# Altium project FlightController.PrjPcb
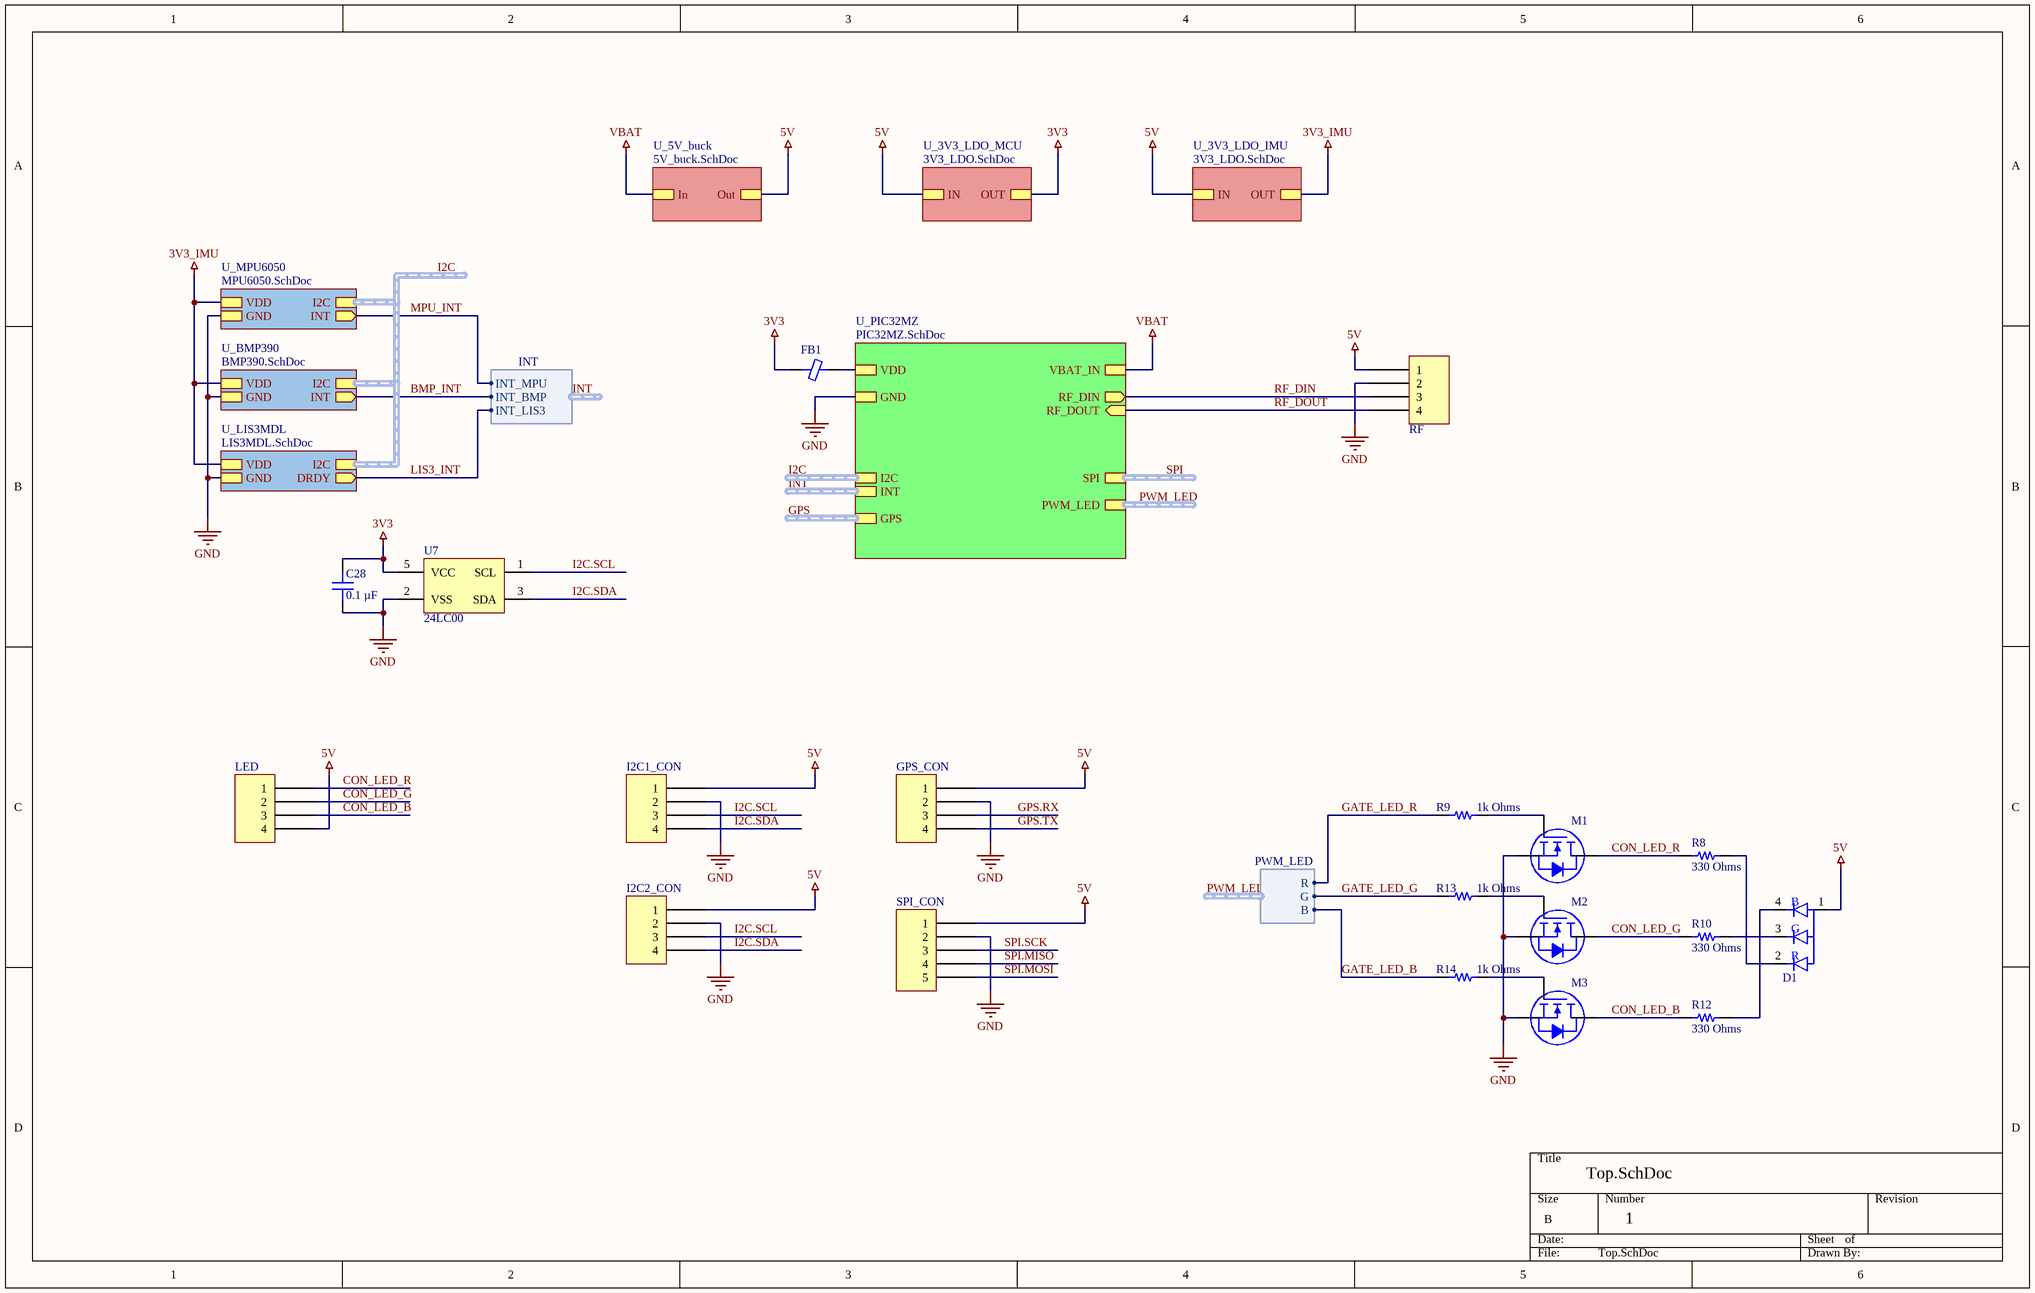
[diagram p0: Top.SchDoc]
3 sheets, 52 parts. Net scope: hierarchical (ports join the sheet entries above them; power ports are global).
Board file: FlightController.PcbDoc
Sheets:
  Top.SchDoc
    U_PIC32MZ = PIC32MZ.SchDoc
    U_3V3_LDO_MCU = 3V3_LDO.SchDoc
    U_3V3_LDO_IMU = 3V3_LDO.SchDoc

## Sheet Top.SchDoc
size B; SheetNumber: 1; SheetTotal: 7

### Parts
C28  0.1 µF  [CAP 0402_1005]
D1  RGB LED 3228  [CreeLED 3228]  (value not drawn)
FB1  (no value)  [FER 0805_2012]
GPS_CON  SM04B-SRSS-TB(LF)(SN)  [JST SM04B-SRSS-TB]  (value not drawn)
I2C1_CON  SM04B-SRSS-TB(LF)(SN)  [JST SM04B-SRSS-TB]  (value not drawn)
I2C2_CON  SM04B-SRSS-TB(LF)(SN)  [JST SM04B-SRSS-TB]  (value not drawn)
LED  SM04B-SRSS-TB(LF)(SN)  [JST SM04B-SRSS-TB]  (value not drawn)
M1  BSS123-7-F  [DIODES SOT-23-3]  (value not drawn)
M2  BSS123-7-F  [DIODES SOT-23-3]  (value not drawn)
M3  BSS123-7-F  [DIODES SOT-23-3]  (value not drawn)
R8  330 Ohms  [RES 0603_1608]
R9  1k Ohms  [RES 0402_1005]
R10  330 Ohms  [RES 0603_1608]
R12  330 Ohms  [RES 0603_1608]
R13  1k Ohms  [RES 0402_1005]
R14  1k Ohms  [RES 0402_1005]
RF  SM04B-SRSS-TB(LF)(SN)  [JST SM04B-SRSS-TB]  (value not drawn)
SPI_CON  SM05B-SRSS-TB(LF)(SN)  [JST SM05B-SRSS-TB]  (value not drawn)
U7  24LC00  [SOT-23-5]

### Sub-sheets
U_3V3_LDO_IMU = 3V3_LDO.SchDoc: OUT, IN
U_3V3_LDO_MCU = 3V3_LDO.SchDoc: OUT, IN
U_5V_buck = 5V_buck.SchDoc (file not in this document): Out, In
U_BMP390 = BMP390.SchDoc (file not in this document): VDD, GND, I2C (harness I2C), INT (out)
U_LIS3MDL = LIS3MDL.SchDoc (file not in this document): VDD, GND, I2C (harness I2C), DRDY (out)
U_MPU6050 = MPU6050.SchDoc (file not in this document): VDD, GND, I2C (harness I2C), INT (out)
U_PIC32MZ = PIC32MZ.SchDoc: RF_DIN (out), RF_DOUT (in), GND, VDD, VBAT_IN, I2C (harness I2C), GPS (harness GPS), PWM_LED (harness PWM_LED), INT (harness INT), SPI (harness SPI)

### Harnesses
PWM_LED: R, B, G
INT: INT_MPU, INT_BMP, INT_LIS3

### Nets
3V3: C28.2 FB1.1 U7.5(VCC) ; sheet U_3V3_LDO_MCU/OUT
3V3_IMU: sheet U_3V3_LDO_IMU/OUT, sheet U_MPU6050/VDD, sheet U_BMP390/VDD, sheet U_LIS3MDL/VDD
5V: D1.1(A) GPS_CON.1 I2C1_CON.1 I2C2_CON.1 LED.4 RF.1 SPI_CON.1 ; sheet U_3V3_LDO_MCU/IN, sheet U_3V3_LDO_IMU/IN, sheet U_5V_buck/Out
GND: C28.1 GPS_CON.2 I2C1_CON.2 I2C2_CON.2 M1.2(S) M2.2(S) M3.2(S) RF.2 SPI_CON.2 U7.2(VSS) ; sheet U_PIC32MZ/GND, sheet U_MPU6050/GND, sheet U_BMP390/GND, sheet U_LIS3MDL/GND
VBAT: sheet U_PIC32MZ/VBAT_IN, sheet U_5V_buck/In
BMP_INT: sheet U_BMP390/INT, sheet U_PIC32MZ/INT.INT_BMP
CON_LED_B: LED.3 M3.3(D) R12.1
CON_LED_G: LED.2 M2.3(D) R10.1
CON_LED_R: LED.1 M1.3(D) R8.1
GATE_LED_B: R14.2 ; sheet U_PIC32MZ/PWM_LED.B
GATE_LED_G: R13.2 ; sheet U_PIC32MZ/PWM_LED.G
GATE_LED_R: R9.2 ; sheet U_PIC32MZ/PWM_LED.R
GPS.RX: GPS_CON.3
GPS.TX: GPS_CON.4
I2C.SCL: I2C1_CON.3 I2C2_CON.3 U7.1(SCL)
I2C.SDA: I2C1_CON.4 I2C2_CON.4 U7.3(SDA)
LIS3_INT: sheet U_LIS3MDL/DRDY, sheet U_PIC32MZ/INT.INT_LIS3  [project net INT.INT_LIS3]
MCU_VDD: FB1.2 ; sheet U_PIC32MZ/VDD
MPU_INT: sheet U_MPU6050/INT, sheet U_PIC32MZ/INT.INT_MPU  [project net INT.INT_MPU]
RF_DIN: RF.3 ; sheet U_PIC32MZ/RF_DIN
RF_DOUT: RF.4 ; sheet U_PIC32MZ/RF_DOUT
SPI.MISO: SPI_CON.4
SPI.MOSI: SPI_CON.5
SPI.SCK: SPI_CON.3
NetD1_2: D1.2(BLUE(C)) R8.2
NetD1_3: D1.3(BLUE(C)) R10.2
NetD1_4: D1.4(BLUE(C)) R12.2
NetM1_1: M1.1(G) R9.1
NetM2_1: M2.1(G) R13.1
NetM3_1: M3.1(G) R14.1

### Buses and harness runs
harness GPS = sheet U_PIC32MZ/GPS
harness I2C = sheet U_BMP390/I2C = sheet U_LIS3MDL/I2C = sheet U_MPU6050/I2C
harness I2C = sheet U_PIC32MZ/I2C
harness INT = sheet U_PIC32MZ/INT
harness PWM_LED = sheet U_PIC32MZ/PWM_LED
harness SPI = sheet U_PIC32MZ/SPI

### Notes on the sheet
- (in symbol RGB LED 3228) B; G; R

### Library data of the parts
C28 = C0402C104K4RACAUTO: CAP CER 0.1UF 16V X7R 0402; manufacturer: KEMET; Tolerance: ±10%; Part Number: C0402C104K4RACAUTO; Value: 0.1 µF; Applications: Automotive, Bypass, Decoupling; Capacitance: 0.1 µF; componentlink1description: Datasheet; componentlink1url: https://api.kemet.com/component-edge/download/specsheet/C0402C104K4RACAUTO.pdf; componentlink2description: DigiKey Link; componentlink2url: https://www.digikey.com/en/products/detail/kemet/C0402C104K4RACAUTO/3314827; Device Package: 0402 (1005 Metric); lastupdated: 8/14/2022 9:05:51 PM; Lifecycle Status: Active; Minimum Order: 1; Mounting Type: Surface Mount, MLCC; Operating Temperature: -55°C ~ 125°C; Package / Case: 0402 (1005 Metric); packaging: TapeAndReel; partid: 3024; Part Status: Active; price: 0.01; Ratings: AEC-Q200; series: SMD Auto X7R; Size / Dimension: 0.039" L x 0.020" W (1.00mm x 0.50mm); Supplier 1: DigiKey; Supplier Part Number 1: 399-6828-1-ND; Temperature Coefficient: X7R; Thickness (Max): 0.022" (0.55mm); Voltage - Rated: 16V
D1 = RGB LED 3228: DIODE LED RGB DIFFUSED 4LCC SMD CLV1L-FKB-CJ1N1E1BB7B3B3; Manufacturer: Cree; ComponentLink2Description: Datasheet; Temperature: -40°C to +100°C; Package: LED_3MM2X2MM8; Supplier 2: Mouser; Price: 0.203999996142; Supplier 1: Digi-Key; ComponentLink1URL: https://upverter.com/upn/revision/9d0b31f7b1982705/; Supplier Part Number 2: 941-CLV1LFKBC7673673; Supplier Part Number 1: CLV1L-FKB-CHMMQEHBB7673673-ND; ComponentLink1Description: Upverter; ComponentLink2URL: http://www.cree.com/~/media/Files/Cree/LED-Components-and-Modules/HB/Data-Sheets/CLV1L-FKB-1238.pdf; RoHS: TRUE; Mouser Part Number: 941-CLV1LFKBC7673673; Temperature Range High: +100°C; Digikey Description: DIODE LED RGB DIFFUSED 4LCC SMD; Digikey Part Number: CLV1L-FKB-CHMMQEHBB7673673-ND; Lead Free: yes; Temperature Range Low: -40°C
FB1 = 2508051017Y0: FERRITE BEAD 0805 1LN; Manufacturer: Fair-Rite Products Corp.; Current Rating (Max): 300mA; DC Resistance (DCR) (Max): 200mOhm; Filter Type: Signal Line; Number of Lines: 1; Part Number: 2508051017Y0; ComponentLink1Description: Datasheet; ComponentLink1URL: http://www.fair-rite.com/wp-content/themes/fair-rite/print_product.php?pid=19091; ComponentLink2Description: DigiKey Link; ComponentLink2URL: http://digikey.com/product-detail/en/fair-rite-products-corp/2508051017Y0/1934-1435-1-ND/8594382; Device Package: 0805 (2012 Metric); Height (Max): 0.043" (1.10mm); LastUpdated: 9/2/2020 1:18:22 AM; Lifecycle Status: Active; Minimum Order: 1; Mounting Type: Surface Mount; Operating Temperature: -55°C ~ 125°C; Package / Case: 0805 (2012 Metric); Packaging: TapeAndReel; PartId: 1308; Part Status: Active; Price: 0.02; Series: -; Size / Dimension: 0.079" L x 0.049" W (2.00mm x 1.25mm); Supplier 1: DigiKey; Supplier Part Number 1: 1934-1435-1-ND
GPS_CON I2C1_CON I2C2_CON LED RF = SM04B-SRSS-TB(LF)(SN): CONN HEADER SMD R/A 4POS 1MM; Manufacturer: JST Sales America Inc.; Current Rating (Amps): 0.7A; Material Flammability Rating: UL94 V-0; Number of Positions: 4; Number of Positions Loaded: All; Pitch - Mating: 0.039" (1.00mm); Shrouding: Shrouded - 4 Wall; Style: Board to Cable/Wire; Voltage Rating: 50V; Part Number: SM04B-SRSS-TB(LF)(SN); ComponentLink1Description: Datasheet; ComponentLink1URL: http://www.jst-mfg.com/product/pdf/eng/eSH.pdf; ComponentLink2Description: DigiKey Link; ComponentLink2URL: http://digikey.com/product-detail/en/jst-sales-america-inc/SM04B-SRSS-TB-LF-SN/455-1804-1-ND/926875; Connector Type: Header; Contact Finish - Mating: Tin; Contact Finish - Post: Tin; Contact Material: Copper Alloy; Contact Shape: Square; Contact Type: Male Pin; Fastening Type: Push-Pull; Features: Solder Retention; Insulation Color: Natural; Insulation Height: 0.114" (2.90mm); Insulation Material: Polyamide (PA), Nylon; LastUpdated: 1/12/2020 11:41:52 PM; Lifecycle Status: Active; Minimum Order: 1; Mounting Type: Surface Mount, Right Angle; Number of Rows: 1; Operating Temperature: -25°C ~ 85°C; Packaging: TapeAndReel; PartId: 62; Part Status: Active; Price: 0.26; Series: SR; Supplier 1: DigiKey; Supplier Part Number 1: 455-1804-1-ND; Termination: Solder
M1-M3 = BSS123-7-F: MOSFET N-CH 100V 170MA SOT23-3; Manufacturer: Diodes Incorporated; Current - Continuous Drain (Id) @ 25°C: 170mA (Ta); Drive Voltage (Max Rds On,  Min Rds On): 10V; FET Type: N-Channel; Input Capacitance (Ciss) (Max) @ Vds: 60pF @ 25V; Power Dissipation (Max): 300mW (Ta); Rds On (Max) @ Id, Vgs: 6Ohm @ 170mA, 10V; Vgs (Max): ±20V; Vgs(th) (Max) @ Id: 2V @ 1mA; Part Number: BSS123-7-F; ComponentLink1Description: Datasheet; ComponentLink1URL: https://www.diodes.com/assets/Datasheets/ds30366.pdf; ComponentLink2Description: DigiKey Link; ComponentLink2URL: http://digikey.com/product-detail/en/diodes-incorporated/BSS123-7-F/BSS123-FDICT-ND/717842; Drain to Source Voltage (Vdss): 100V; LastUpdated: 8/14/2022 10:06:21 PM; Lifecycle Status: Active; Minimum Order: 1; Mounting Type: Surface Mount; Operating Temperature: -55°C ~ 150°C (TJ); Package / Case: TO-236-3, SC-59, SOT-23-3; Packaging: TapeAndReel; Part Status: Active; Price: 0.05; Series: -; Supplier 1: DigiKey; Supplier Part Number 1: BSS123-FDICT-ND; Supplier Device Package: SOT-23-3; Technology: MOSFET (Metal Oxide)
R8 R10 R12 = RNCS0603BKE10K0: RES 10K OHM 0.1% 1/16W 0603; Manufacturer: Stackpole Electronics Inc; Power (Watts): 0.063W, 1/16W; Resistance: 10 kOhms; Temperature Coefficient: ±25ppm/°C; Part Number: RNCS0603BKE10K0; Value: 330 Ohms; ComponentLink1Description: Datasheet; ComponentLink1URL: https://www.seielect.com/catalog/sei-rncs_rnch.pdf; ComponentLink2Description: DigiKey Link; ComponentLink2URL: https://www.digikey.com/en/products/detail/stackpole-electronics-inc/RNCS0603BKE10K0/1708836; Composition: Thin Film; Device Package: 0603 (1608 Metric); Features: Anti-Corrosive, Automotive AEC-Q200, Moisture Resistant; Height - Seated (Max): 0.022" (0.55mm); LastUpdated: 8/14/2022 9:31:27 PM; Lifecycle Status: Active; Minimum Order: 1; Number of Terminations: 2; Operating Temperature: -55°C ~ 155°C; Package / Case: 0603 (1608 Metric); Packaging: TapeAndReel; PartId: 4838; Part Status: Active; Price: 0.08; Ratings: AEC-Q200; Series: RNCS; Size / Dimension: 0.061" L x 0.031" W (1.55mm x 0.80mm); Supplier 1: DigiKey; Supplier Part Number 1: RNCS0603BKE10K0CT-ND; Supplier Device Package: 0603; Tolerance: ±0.1%
R9 R13 R14 = CRCW0402330RJNEDC: RES 330 OHM 5% 1/16W 0402; Manufacturer: Vishay Dale; Power (Watts): 0.063W, 1/16W; Resistance: 330 Ohms; Temperature Coefficient: ±200ppm/°C; Part Number: CRCW0402330RJNEDC; Value: 1k Ohms; ComponentLink1Description: Datasheet; ComponentLink1URL: http://www.vishay.com/docs/28773/crcwce3.pdf; ComponentLink2Description: DigiKey Link; ComponentLink2URL: https://www.digikey.com/en/products/detail/vishay-dale/CRCW0402330RJNEDC/7928545; Composition: Thick Film; Device Package: 0402 (1005 Metric); Height - Seated (Max): 0.014" (0.35mm); LastUpdated: 8/14/2022 9:23:31 PM; Lifecycle Status: Active; Minimum Order: 1; Number of Terminations: 2; Operating Temperature: -55°C ~ 155°C; Package / Case: 0402 (1005 Metric); Packaging: CutTape; PartId: 15989; Part Status: Active; Price: 0.01; Series: CRCW-C; Size / Dimension: 0.039" L x 0.020" W (1.00mm x 0.50mm); Supplier 1: DigiKey; Supplier Part Number 1: 541-4123-1-ND; Supplier Device Package: 0402; Tolerance: ±5%
SPI_CON = SM05B-SRSS-TB(LF)(SN): CONN HEADER SMD R/A 5POS 1MM; Manufacturer: JST Sales America Inc.; Current Rating (Amps): 0.7A; Material Flammability Rating: UL94 V-0; Number of Positions: 5; Number of Positions Loaded: All; Pitch - Mating: 0.039" (1.00mm); Shrouding: Shrouded - 4 Wall; Style: Board to Cable/Wire; Voltage Rating: 50V; Part Number: SM05B-SRSS-TB(LF)(SN); ComponentLink1Description: Datasheet; ComponentLink1URL: http://www.jst-mfg.com/product/pdf/eng/eSH.pdf; ComponentLink2Description: DigiKey Link; ComponentLink2URL: http://digikey.com/product-detail/en/jst-sales-america-inc/SM05B-SRSS-TB-LF-SN/455-1805-1-ND/926876; Connector Type: Header; Contact Finish - Mating: Tin; Contact Finish - Post: Tin; Contact Material: Copper Alloy; Contact Shape: Square; Contact Type: Male Pin; Fastening Type: Push-Pull; Features: Solder Retention; Insulation Color: Natural; Insulation Height: 0.114" (2.90mm); Insulation Material: Polyamide (PA), Nylon; LastUpdated: 1/12/2020 11:42:04 PM; Lifecycle Status: Active; Minimum Order: 1; Mounting Type: Surface Mount, Right Angle; Number of Rows: 1; Operating Temperature: -25°C ~ 85°C; Packaging: TapeAndReel; PartId: 63; Part Status: Active; Price: 0.32; Series: SR; Supplier 1: DigiKey; Supplier Part Number 1: 455-1805-1-ND; Termination: Solder
U7 = 24LC00: EEPROM

## Sheet PIC32MZ.SchDoc
size B; SheetNumber: 2; SheetTotal: 7
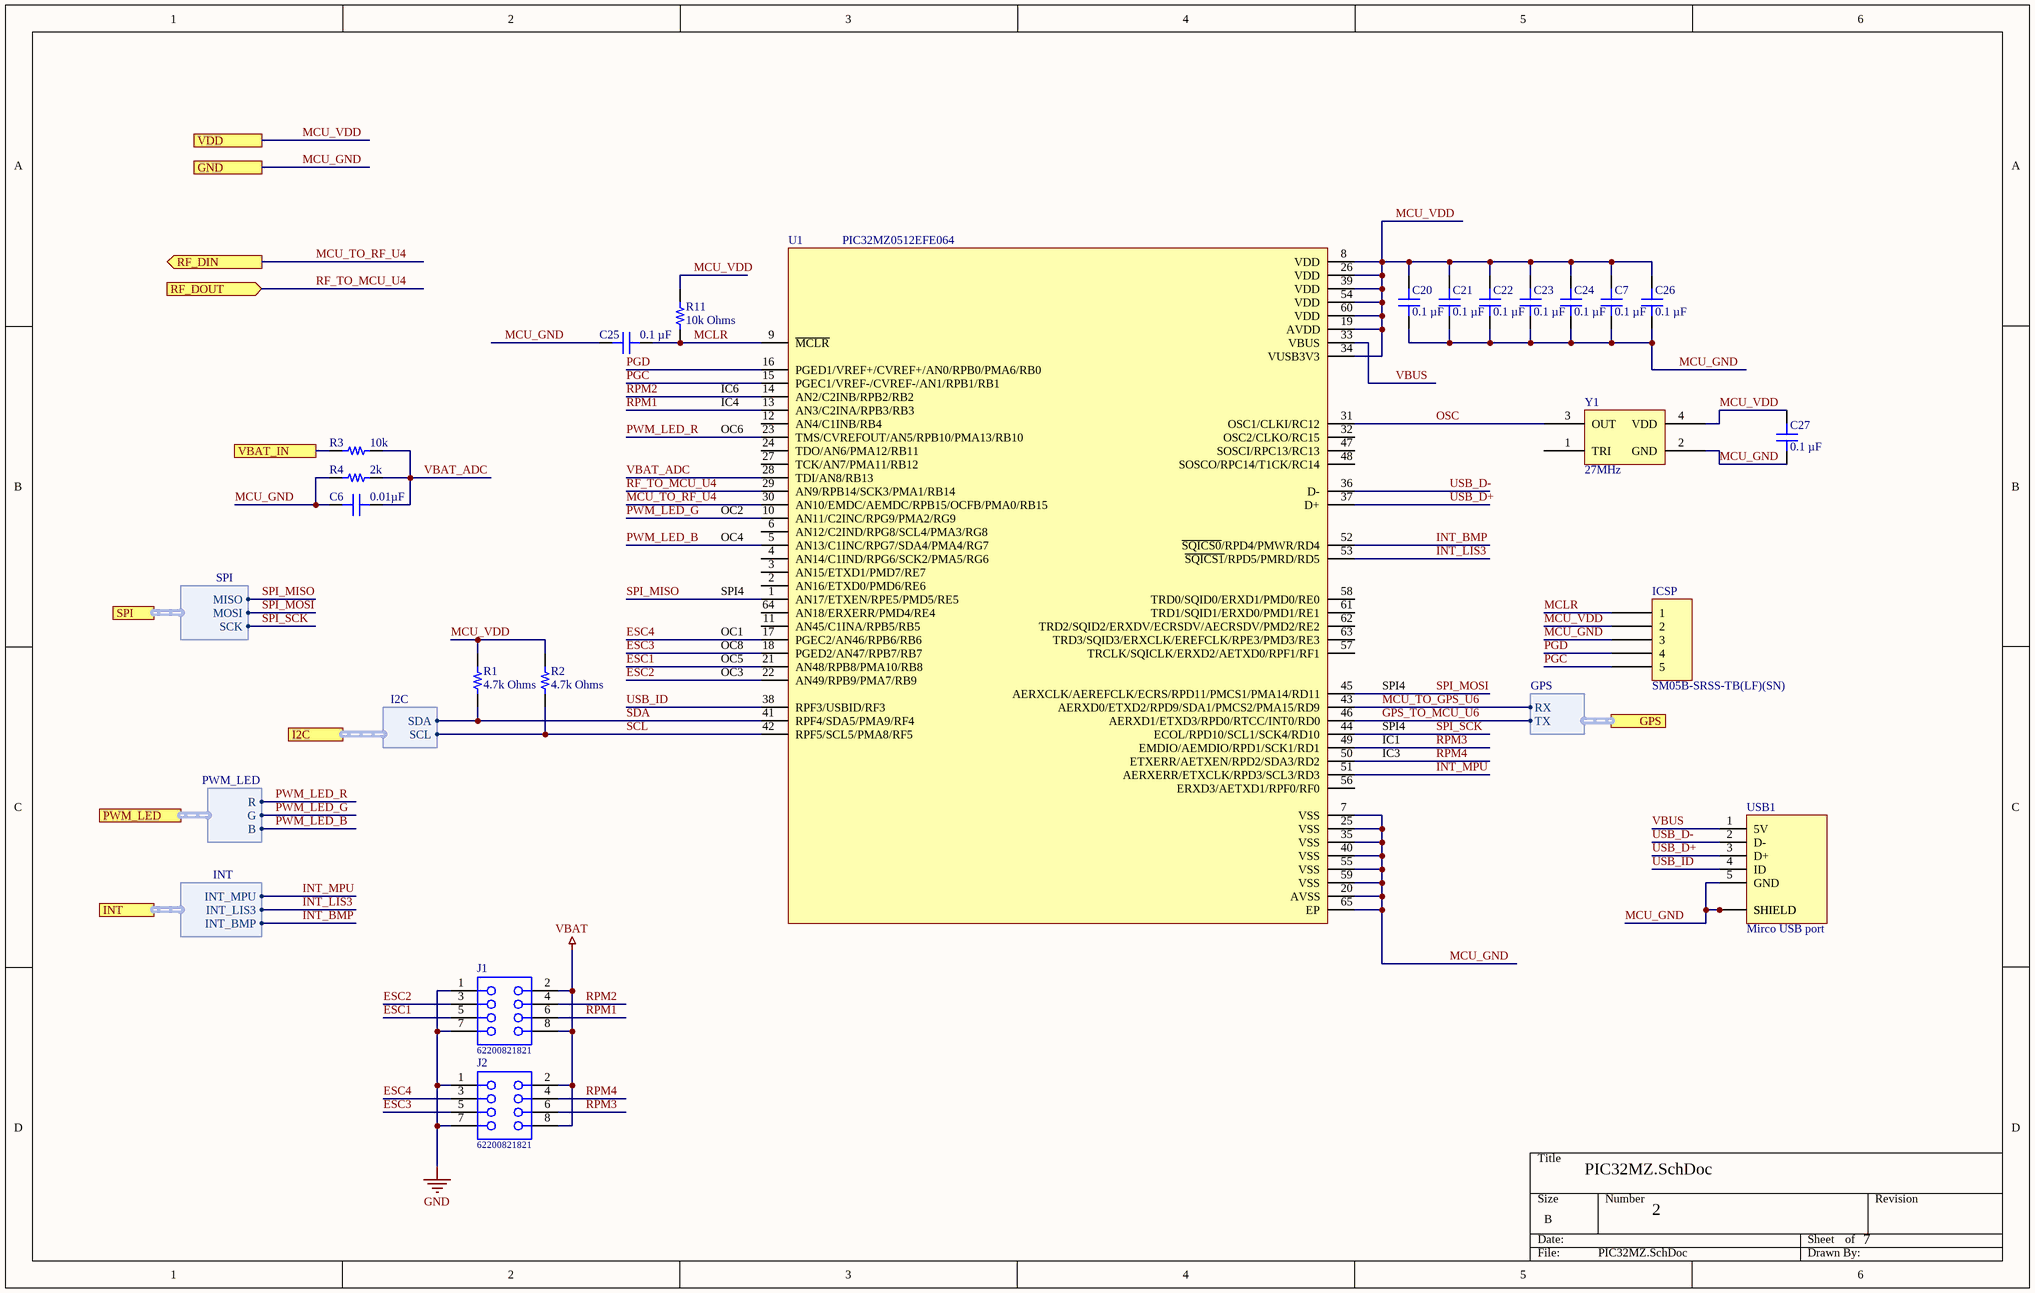
[diagram p1: PIC32MZ.SchDoc]

### Parts
C6  0.01µF  [CAP 0603_1608]
C7  0.1 µF  [CAP 0402_1005]
C20  0.1 µF  [CAP 0402_1005]
C21  0.1 µF  [CAP 0402_1005]
C22  0.1 µF  [CAP 0402_1005]
C23  0.1 µF  [CAP 0402_1005]
C24  0.1 µF  [CAP 0402_1005]
C25  0.1 µF  [CAP 0402_1005]
C26  0.1 µF  [CAP 0402_1005]
C27  0.1 µF  [CAP 0402_1005]
ICSP  SM05B-SRSS-TB(LF)(SN)  [JST SM05B-SRSS-TB]
J1  62200821821  [62200821821]
J2  62200821821  [62200821821]
R1  4.7k Ohms  [RES 0402_1005]
R2  4.7k Ohms  [RES 0402_1005]
R3  10k  [RES 0603_1608]
R4  2k  [RES 0603_1608]
R11  10k Ohms  [RES 0402_1005]
U1  PIC32MZ0512EFE064  [QFN50P900X900X100-65N]
USB1  Mirco USB port  [AMPHENOL_10118194-0001LF]
Y1  27MHz  [ABRACON ASD]

### Ports
GND, GPS (harness GPS), I2C (harness I2C), INT (harness INT), PWM_LED (harness PWM_LED), RF_DIN (out), RF_DOUT (in), SPI (harness SPI), VBAT_IN, VDD

### Harnesses
I2C: SDA, SCL
SPI: MISO, SCK, MOSI
GPS: RX, TX
PWM_LED: R, B, G
INT: INT_MPU, INT_BMP, INT_LIS3

### Nets
GND: C6.2 C7.1 C20.1 C21.1 C22.1 C23.1 C24.1 C25.2 C26.1 C27.1 ICSP.3 J1.1 J1.7 J2.1 J2.7 R4.1 U1.7(VSS) U1.20(AVSS) U1.25(VSS) U1.35(VSS) U1.40(VSS) U1.55(VSS) U1.59(VSS) U1.65(EP) USB1.5(GND) USB1.S1(SHIELD) USB1.S2(SHIELD) USB1.S3(SHIELD) USB1.S4(SHIELD) USB1.S5(SHIELD) USB1.S6(SHIELD) Y1.2(GND) ; port GND  [also labelled MCU_GND]
VBAT: J1.2 J1.8 J2.2 J2.8 R3.2 ; port VBAT_IN
ESC1: J1.5 U1.21(AN48/RPB8/PMA10/RB8)
ESC2: J1.3 U1.22(AN49/RPB9/PMA7/RB9)
ESC3: J2.5 U1.18(PGED2/AN47/RPB7/RB7)
ESC4: J2.3 U1.17(PGEC2/AN46/RPB6/RB6)
GPS_TO_MCU_U6: U1.46(AERXD1/ETXD3/RPD0/RTCC/INT0/RD0) ; port GPS.TX  [project net GPS.TX]
INT_BMP: U1.52(~{SQICS0}/RPD4/PMWR/RD4) ; port INT.INT_BMP  [project net BMP_INT]
INT_LIS3: U1.53(~{SQICS1}/RPD5/PMRD/RD5) ; port INT.INT_LIS3  [project net INT.INT_LIS3]
INT_MPU: U1.51(AERXERR/ETXCLK/RPD3/SCL3/RD3) ; port INT.INT_MPU  [project net INT.INT_MPU]
MCLR: C25.1 ICSP.1 R11.1 U1.9(~{MCLR})
MCU_TO_GPS_U6: U1.43(AERXD0/ETXD2/RPD9/SDA1/PMCS2/PMA15/RD9) ; port GPS.RX  [project net GPS.RX]
MCU_TO_RF_U4: U1.30(AN10/EMDC/AEMDC/RPB15/OCFB/PMA0/RB15) ; port RF_DIN  [project net RF_DIN]
MCU_VDD: C7.2 C20.2 C21.2 C22.2 C23.2 C24.2 C26.2 C27.2 ICSP.2 R1.2 R2.2 R11.2 U1.8(VDD) U1.19(AVDD) U1.26(VDD) U1.34(VUSB3V3) U1.39(VDD) U1.54(VDD) U1.60(VDD) Y1.4(VDD) ; port VDD
OSC: U1.31(OSC1/CLKI/RC12) Y1.3(OUT)
PGC: ICSP.5 U1.15(PGEC1/VREF-/CVREF-/AN1/RPB1/RB1)
PGD: ICSP.4 U1.16(PGED1/VREF+/CVREF+/AN0/RPB0/PMA6/RB0)
PWM_LED_B: U1.5(AN13/C1INC/RPG7/SDA4/PMA4/RG7) ; port PWM_LED.B  [project net GATE_LED_B]
PWM_LED_G: U1.10(AN11/C2INC/RPG9/PMA2/RG9) ; port PWM_LED.G  [project net GATE_LED_G]
PWM_LED_R: U1.23(TMS/CVREFOUT/AN5/RPB10/PMA13/RB10) ; port PWM_LED.R  [project net GATE_LED_R]
RF_TO_MCU_U4: U1.29(AN9/RPB14/SCK3/PMA1/RB14) ; port RF_DOUT  [project net RF_DOUT]
RPM1: J1.6 U1.13(AN3/C2INA/RPB3/RB3)
RPM2: J1.4 U1.14(AN2/C2INB/RPB2/RB2)
RPM3: J2.6 U1.49(EMDIO/AEMDIO/RPD1/SCK1/RD1)
RPM4: J2.4 U1.50(ETXERR/AETXEN/RPD2/SDA3/RD2)
SCL: R2.1 U1.42(RPF5/SCL5/PMA8/RF5) ; port I2C.SCL  [project net I2C.SCL]
SDA: R1.1 U1.41(RPF4/SDA5/PMA9/RF4) ; port I2C.SDA  [project net I2C.SDA]
SPI_MISO: U1.1(AN17/ETXEN/RPE5/PMD5/RE5) ; port SPI.MISO  [project net SPI.MISO]
SPI_MOSI: U1.45(AERXCLK/AEREFCLK/ECRS/RPD11/PMCS1/PMA14/RD11) ; port SPI.MOSI  [project net SPI.MOSI]
SPI_SCK: U1.44(ECOL/RPD10/SCL1/SCK4/RD10) ; port SPI.SCK  [project net SPI.SCK]
USB_D+: U1.37(D+) USB1.3(D+)
USB_D-: U1.36(D-) USB1.2(D-)
USB_ID: U1.38(RPF3/USBID/RF3) USB1.4(ID)
VBAT_ADC: C6.1 R3.1 R4.2 U1.28(TDI/AN8/RB13)
VBUS: U1.33(VBUS) USB1.1(5V)

Not connected (* = marked no-connect by the designer): U1 2(AN16/ETXD0/PMD6/RE6) 3(AN15/ETXD1/PMD7/RE7) 4(AN14/C1IND/RPG6/SCK2/PMA5/RG6) 6(AN12/C2IND/RPG8/SCL4/PMA3/RG8) 11(AN45/C1INA/RPB5/RB5) 12(AN4/C1INB/RB4) 24(TDO/AN6/PMA12/RB11) 27(TCK/AN7/PMA11/RB12) 32(OSC2/CLKO/RC15) 47(SOSCI/RPC13/RC13) 48(SOSCO/RPC14/T1CK/RC14) 56(ERXD3/AETXD1/RPF0/RF0) 57(TRCLK/SQICLK/ERXD2/AETXD0/RPF1/RF1) 58(TRD0/SQID0/ERXD1/PMD0/RE0) 61(TRD1/SQID1/ERXD0/PMD1/RE1) 62(TRD2/SQID2/ERXDV/ECRSDV/AECRSDV/PMD2/RE2) 63(TRD3/SQID3/ERXCLK/EREFCLK/RPE3/PMD3/RE3) 64(AN18/ERXERR/PMD4/RE4); Y1 1(TRI)

### Notes on the sheet
- (near U1) IC4
- IC6
- (near U1) OC6
- (near U1) OC2
- (near U1) OC4
- (near U1) OC1
- (near U1) SPI4
- (near U1) OC5
- (near U1) OC3
- (near U1) OC8
- SPI4
- IC1
- IC3

### Library data of the parts
C6 = GCG188R92A104KA03D: CAP CER 0.1UF 100V 0603 EPOXY; Manufacturer: Murata Electronics; Capacitance: 0.1µF; Temperature Coefficient: X8R; Tolerance: ±10%; Part Number: GCG188R92A104KA03D; Value: 0.01µF; Applications: Automotive; ComponentLink1Description: Datasheet; ComponentLink1URL: https://search.murata.co.jp/Ceramy/image/img/A01X/G101/ENG/GCG188R92A104KA03-01.pdf; ComponentLink2Description: DigiKey Link; ComponentLink2URL: http://digikey.com/product-detail/en/murata-electronics/GCG188R92A104KA03D/490-18197-1-ND/9867926; Device Package: 0603 (1608 Metric); Features: Epoxy Mountable; LastUpdated: 21-Jan-20 12:01:59 AM; Lifecycle Status: Active; Minimum Order: 1; Mounting Type: Surface Mount, MLCC, Epoxy; Operating Temperature: -55°C ~ 150°C; Package / Case: 0603 (1608 Metric); Packaging: TapeAndReel; PartId: 9025; Part Status: Active; Price: 0.07; Ratings: AEC-Q200; Series: GCG; Size / Dimension: 0.063" L x 0.031" W (1.60mm x 0.80mm); Supplier 1: DigiKey; Supplier Part Number 1: 490-18197-1-ND; Thickness (Max): 0.035" (0.90mm); Voltage - Rated: 100V
C7 C20-C27 = C0402C104K4RACAUTO: as C28 on sheet Top; Part Number: C0402C104K4RACAUTO; Value: 0.1 µF; Applications: Automotive, Bypass, Decoupling; Capacitance: 0.1 µF; componentlink1description: Datasheet; componentlink1url: https://api.kemet.com/component-edge/download/specsheet/C0402C104K4RACAUTO.pdf; componentlink2description: DigiKey Link; componentlink2url: https://www.digikey.com/en/products/detail/kemet/C0402C104K4RACAUTO/3314827; Device Package: 0402 (1005 Metric); lastupdated: 8/14/2022 9:05:51 PM; Lifecycle Status: Active; Minimum Order: 1; Mounting Type: Surface Mount, MLCC; Operating Temperature: -55°C ~ 125°C; Package / Case: 0402 (1005 Metric); packaging: TapeAndReel; partid: 3024; Part Status: Active; price: 0.01; Ratings: AEC-Q200; series: SMD Auto X7R; Size / Dimension: 0.039" L x 0.020" W (1.00mm x 0.50mm); Supplier 1: DigiKey; Supplier Part Number 1: 399-6828-1-ND; Temperature Coefficient: X7R; Thickness (Max): 0.022" (0.55mm); Voltage - Rated: 16V
ICSP = SM05B-SRSS-TB(LF)(SN): as SPI_CON on sheet Top; Part Number: SM05B-SRSS-TB(LF)(SN); ComponentLink1Description: Datasheet; ComponentLink1URL: http://www.jst-mfg.com/product/pdf/eng/eSH.pdf; ComponentLink2Description: DigiKey Link; ComponentLink2URL: http://digikey.com/product-detail/en/jst-sales-america-inc/SM05B-SRSS-TB-LF-SN/455-1805-1-ND/926876; Connector Type: Header; Contact Finish - Mating: Tin; Contact Finish - Post: Tin; Contact Material: Copper Alloy; Contact Shape: Square; Contact Type: Male Pin; Fastening Type: Push-Pull; Features: Solder Retention; Insulation Color: Natural; Insulation Height: 0.114" (2.90mm); Insulation Material: Polyamide (PA), Nylon; LastUpdated: 1/12/2020 11:42:04 PM; Lifecycle Status: Active; Minimum Order: 1; Mounting Type: Surface Mount, Right Angle; Number of Rows: 1; Operating Temperature: -25°C ~ 85°C; Packaging: TapeAndReel; PartId: 63; Part Status: Active; Price: 0.32; Series: SR; Supplier 1: DigiKey; Supplier Part Number 1: 455-1805-1-ND; Termination: Solder
J1 J2 = 62200821821: WR-PHD Socket Header, THT, pitch 1.27mm, Dual Row, Vertical, 8p; Manufacturer: Wurth Elektronik; Pin Number: 8; Rated Current: 1A; Working Voltage: 250VAC; Withstanding Voltage: 500VAC; Contact Resistance: 20mOhm; System: Connector; ComponentLink1Description: Manufacturer; ComponentLink1URL: http://www.we-online.de; ComponentLink2Description: Datasheet; ComponentLink2URL: https://www.we-online.com/catalog/datasheet/62200821821.pdf; Manufacturer Part Number: 62200821821; Published Date: May 2020; Pitch: 1.27mm; Operating Temperature: -40 to +105degC; Mounting Technology: THT; Packaging: Tube; Gender: Socket Header; Row Number: Dual; Orientation: Vertical
R1 R2 R11 = CRCW0402330RJNEDC: as R9 on sheet Top; Part Number: CRCW0402330RJNEDC; ComponentLink1Description: Datasheet; ComponentLink1URL: http://www.vishay.com/docs/28773/crcwce3.pdf; ComponentLink2Description: DigiKey Link; ComponentLink2URL: https://www.digikey.com/en/products/detail/vishay-dale/CRCW0402330RJNEDC/7928545; Composition: Thick Film; Device Package: 0402 (1005 Metric); Height - Seated (Max): 0.014" (0.35mm); LastUpdated: 8/14/2022 9:23:31 PM; Lifecycle Status: Active; Minimum Order: 1; Number of Terminations: 2; Operating Temperature: -55°C ~ 155°C; Package / Case: 0402 (1005 Metric); Packaging: CutTape; PartId: 15989; Part Status: Active; Price: 0.01; Series: CRCW-C; Size / Dimension: 0.039" L x 0.020" W (1.00mm x 0.50mm); Supplier 1: DigiKey; Supplier Part Number 1: 541-4123-1-ND; Supplier Device Package: 0402; Tolerance: ±5%
  R1 R2: Value: 4.7k Ohms
  R11: Value: 10k Ohms
R3 R4 = ERJ-3EKF21R5V: RES SMD 21.5 OHM 1% 1/10W 0603; Manufacturer: Panasonic Electronic Components; Power (Watts): 0.1W, 1/10W; Resistance: 21.5 Ohms; Temperature Coefficient: ±100ppm/°C; Part Number: ERJ-3EKF21R5V; ComponentLink1Description: Datasheet; ComponentLink1URL: https://industrial.panasonic.com/cdbs/www-data/pdf/RDA0000/AOA0000C304.pdf; ComponentLink2Description: DigiKey Link; ComponentLink2URL: http://digikey.com/product-detail/en/panasonic-electronic-components/ERJ-3EKF21R5V/P21.5HCT-ND/198246; Composition: Thick Film; Device Package: 0603 (1608 Metric); Features: Automotive AEC-Q200; Height - Seated (Max): 0.022" (0.55mm); LastUpdated: 21-Jan-20 12:16:19 AM; Lifecycle Status: Active; Minimum Order: 1; Number of Terminations: 2; Operating Temperature: -55°C ~ 155°C; Package / Case: 0603 (1608 Metric); Packaging: TapeAndReel; PartId: 24202; Part Status: Active; Price: 0.01; Ratings: AEC-Q200; Series: ERJ; Size / Dimension: 0.063" L x 0.031" W (1.60mm x 0.80mm); Supplier 1: DigiKey; Supplier Part Number 1: P21.5HCT-ND; Supplier Device Package: 0603; Tolerance: ±1%
  R3: Value: 10k
  R4: Value: 2k
U1 = PIC32MZ0512EFE064-I/PT: 32-bit Microcontrollers - MCU 32-BIT MCU 512KB FL 128KB RAM, No Crypto; MF: Microchip; MP: PIC32MZ2048EFG064T-I/PT; Price: None; Value: *; SnapEDA_Link: https://www.snapeda.com/parts/PIC32MZ2048EFG064T-I/PT/Microchip/view-part/565997/?ref=snap; Package: TQFP-64 Microchip; Availability: Unavailable
USB1 = 10118194-0001LF: USB - micro B USB 2.0 Receptacle Connector 5 Position Surface Mount, Right Angle; Through Hole; MF: Amphenol ICC; Package: None; Price: None; Availability: Unavailable; MP: 10118194-0001LF; SnapEDA_Link: https://www.snapeda.com/parts/10118194-0001LF/Amphenol%20FCI/view-part/1413308/?ref=snap; Value: *
Y1 = ASD3-27.000MHZ-EC-T: XTAL OSC XO 27.0000MHZ HCMOS SMD; Manufacturer: Abracon LLC; Base Resonator: Crystal; Current - Supply (Max): 4mA; Frequency Stability: ±50ppm; Function: Enable/Disable; Voltage - Supply: 1.8V; Part Number: ASD3-27.000MHZ-EC-T; ComponentLink1Description: Datasheet; ComponentLink1URL: https://abracon.com/Oscillators/ASDseries.pdf; ComponentLink2Description: DigiKey Link; ComponentLink2URL: http://digikey.com/product-detail/en/abracon-llc/ASD3-27.000MHZ-EC-T/535-9608-1-ND/1237075; Frequency: 27MHz; Height - Seated (Max): 0.039" (1.00mm); LastUpdated: 9/14/2022 8:37:45 AM; Lifecycle Status: Active; Minimum Order: 1; Mounting Type: Surface Mount; Operating Temperature: -20°C ~ 70°C; Output: HCMOS; Package / Case: 4-SMD, No Lead; Packaging: TapeAndReel; PartId: 4; Part Status: Active; Price: 1.74; Series: ASD; Size / Dimension: 0.098" L x 0.079" W (2.50mm x 2.00mm); Supplier 1: DigiKey; Supplier Part Number 1: 535-9608-1-ND; Type: XO (Standard); Value: 27MHz

## Sheet 3V3_LDO.SchDoc
size A; SheetNumber: 3; SheetTotal: 4
Used 2 times, as channels U_3V3_LDO_MCU, U_3V3_LDO_IMU. Parts and nets are listed once, with the designators drawn on the sheet.
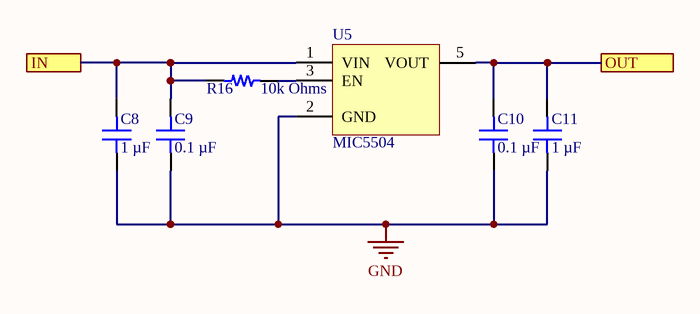
[diagram p2: 3V3_LDO.SchDoc]

### Parts
C8  1 µF  [CAP 0402_1005]
C9  0.1 µF  [CAP 0402_1005]
C10  0.1 µF  [CAP 0402_1005]
C11  1 µF  [CAP 0402_1005]
R16  10k Ohms  [RES 0402_1005]
U5  MIC5504  [TI SOT-23-5 DBV]

### Ports
IN, OUT

### Nets
GND: C8.1 C9.1 C10.1 C11.1 U5.2(GND)
IN: C8.2 C9.2 R16.2 U5.1(VIN) ; port IN
OUT: C10.2 C11.2 U5.5(VOUT) ; port OUT
NetR16_1: R16.1 U5.3(EN)

### Channels
U_3V3_LDO_MCU: designators end in _2; ports IN=5V OUT=3V3
U_3V3_LDO_IMU: designators end in _1; ports IN=5V OUT=3V3_IMU

### Library data of the parts
C8 C11 = C0402C104K4RACAUTO: CAP CER 0.1UF 16V X7R 0402; manufacturer: KEMET; Capacitance: 0.1 µF; Tolerance: ±10%; Part Number: C0402C104K4RACAUTO; Value: 1 µF; Applications: Automotive, Bypass, Decoupling; componentlink1description: Datasheet; componentlink1url: https://api.kemet.com/component-edge/download/specsheet/C0402C104K4RACAUTO.pdf; componentlink2description: DigiKey Link; componentlink2url: https://www.digikey.com/en/products/detail/kemet/C0402C104K4RACAUTO/3314827; Device Package: 0402 (1005 Metric); lastupdated: 8/14/2022 9:05:51 PM; Lifecycle Status: Active; Minimum Order: 1; Mounting Type: Surface Mount, MLCC; Operating Temperature: -55°C ~ 125°C; Package / Case: 0402 (1005 Metric); packaging: TapeAndReel; partid: 3024; Part Status: Active; price: 0.01; Ratings: AEC-Q200; series: SMD Auto X7R; Size / Dimension: 0.039" L x 0.020" W (1.00mm x 0.50mm); Supplier 1: DigiKey; Supplier Part Number 1: 399-6828-1-ND; Temperature Coefficient: X7R; Thickness (Max): 0.022" (0.55mm); Voltage - Rated: 16V
C9 C10 = C0402C104K4RACAUTO: as C28 on sheet Top; Part Number: C0402C104K4RACAUTO; Value: 0.1 µF; Applications: Automotive, Bypass, Decoupling; Capacitance: 0.1 µF; componentlink1description: Datasheet; componentlink1url: https://api.kemet.com/component-edge/download/specsheet/C0402C104K4RACAUTO.pdf; componentlink2description: DigiKey Link; componentlink2url: https://www.digikey.com/en/products/detail/kemet/C0402C104K4RACAUTO/3314827; Device Package: 0402 (1005 Metric); lastupdated: 8/14/2022 9:05:51 PM; Lifecycle Status: Active; Minimum Order: 1; Mounting Type: Surface Mount, MLCC; Operating Temperature: -55°C ~ 125°C; Package / Case: 0402 (1005 Metric); packaging: TapeAndReel; partid: 3024; Part Status: Active; price: 0.01; Ratings: AEC-Q200; series: SMD Auto X7R; Size / Dimension: 0.039" L x 0.020" W (1.00mm x 0.50mm); Supplier 1: DigiKey; Supplier Part Number 1: 399-6828-1-ND; Temperature Coefficient: X7R; Thickness (Max): 0.022" (0.55mm); Voltage - Rated: 16V
R16 = CRCW0402330RJNEDC: as R9 on sheet Top; Part Number: CRCW0402330RJNEDC; Value: 10k Ohms; ComponentLink1Description: Datasheet; ComponentLink1URL: http://www.vishay.com/docs/28773/crcwce3.pdf; ComponentLink2Description: DigiKey Link; ComponentLink2URL: https://www.digikey.com/en/products/detail/vishay-dale/CRCW0402330RJNEDC/7928545; Composition: Thick Film; Device Package: 0402 (1005 Metric); Height - Seated (Max): 0.014" (0.35mm); LastUpdated: 8/14/2022 9:23:31 PM; Lifecycle Status: Active; Minimum Order: 1; Number of Terminations: 2; Operating Temperature: -55°C ~ 155°C; Package / Case: 0402 (1005 Metric); Packaging: CutTape; PartId: 15989; Part Status: Active; Price: 0.01; Series: CRCW-C; Size / Dimension: 0.039" L x 0.020" W (1.00mm x 0.50mm); Supplier 1: DigiKey; Supplier Part Number 1: 541-4123-1-ND; Supplier Device Package: 0402; Tolerance: ±5%
U5 = MIC5504-3.3YM5: 3.3V LDO

## Nets that join several sheets
3V3: Top (C28.2 FB1.1 U7.5), U_3V3_LDO_MCU (C10_2.2 C11_2.2 U5_2.5)
5V: Top (7 pins), U_3V3_LDO_MCU (C8_2.2 C9_2.2 R16_2.2 U5_2.1), U_3V3_LDO_IMU (C8_1.2 C9_1.2 R16_1.2 U5_1.1)
GND: Top (10 pins), PIC32MZ (32 pins), U_3V3_LDO_MCU (5 pins), U_3V3_LDO_IMU (5 pins)
GATE_LED_B: Top (R14.2), PIC32MZ (U1.5)
GATE_LED_G: Top (R13.2), PIC32MZ (U1.10)
GATE_LED_R: Top (R9.2), PIC32MZ (U1.23)
MCU_VDD: Top (FB1.2), PIC32MZ (20 pins)
RF_DIN: Top (RF.3), PIC32MZ (U1.30)
RF_DOUT: Top (RF.4), PIC32MZ (U1.29)

## Assembly variants
Main: all parts fitted